# Altium schematic sheet Sheet_1_2021-12-04.schdoc
size 187 x 111 mm
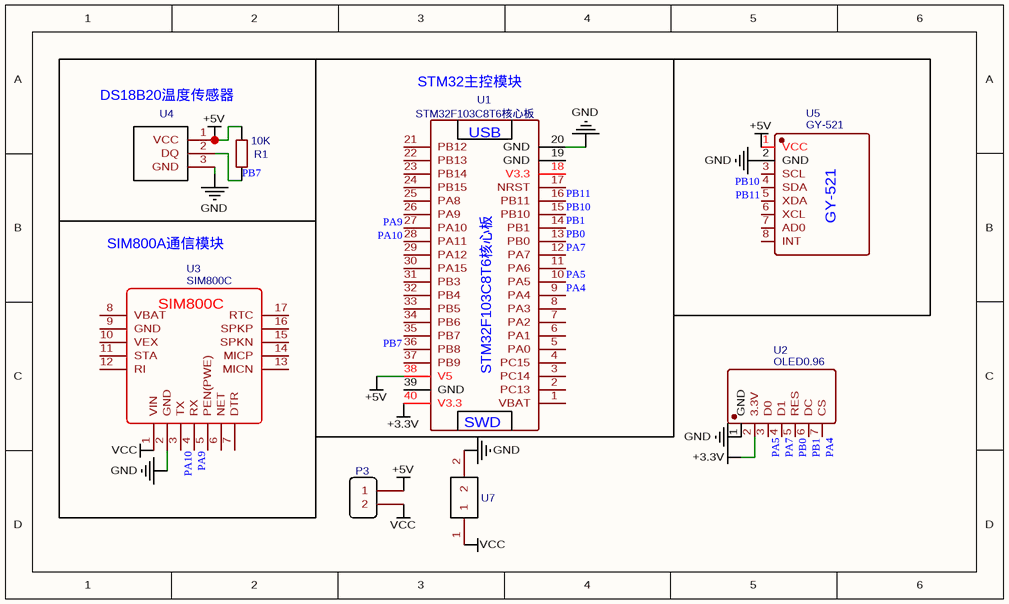
[diagram p0: Sheet_1_2021-12-04.schdoc]

## Parts
P3  2.54-1*2P_ZX  [2.54-1*2P_TIGHT_JX]  (value not drawn)
R1  10K  [AXIAL-0.5]
U1  STM32F103C8T6核心板  [STM32F103C8T6核心板]
U2  OLED0.96  [OLED]
U3  SIM800C  [SIM800C模块-DIP_MK]
U4  DS18B20（防水版）  [DS18B20（防水版）]  (value not drawn)
U5  GY-521  [GY-521_FOOTPRINT]
U7  双排针2×1P  [双排针2×1]  (value not drawn)

## Blocks framed on the sheet
DS18B20温度传感器: R1 U4
STM32主控模块: U1
SIM800A通信模块: U3

## Nets
+3.3V: U1.40(V3.3) U2.2(3.3V)
+5V: P3.1 R1.2 U1.38(V5) U4.1(VCC) U5.1(VCC)
GND: U1.20(GND) U2.1(GND) U3.2(GND) U4.3(GND) U5.2(GND) U7.2
VCC: P3.2 U3.1(VIN) U7.1
PA4: U1.9(PA4) U2.7(CS)
PA5: U1.10(PA5) U2.3(D0)
PA7: U1.12(PA7) U2.4(D1)
PA9: U1.26(PA9) U3.4(RX)
PA10: U1.27(PA10) U3.3(TX)
PB0: U1.13(PB0) U2.5(RES)
PB1: U1.14(PB1) U2.6(DC)
PB7: R1.1 U1.35(PB7) U4.2(DQ)
PB10: U1.15(PB10) U5.3(SCL)
PB11: U1.16(PB11) U5.4(SDA)

Not connected (* = marked no-connect by the designer): U1 1(VBAT) 2(PC13) 3(PC14) 4(PC15) 5(PA0) 6(PA1) 7(PA2) 8(PA3) 11(PA6) 17(NRST) 18(V3.3) 19(GND) 21(PB12) 22(PB13) 23(PB14) 24(PB15) 25(PA8) 28(PA11) 29(PA12) 30(PA15) 31(PB3) 32(PB4) 33(PB5) 34(PB6) 36(PB8) 37(PB9) 39(GND); U3 5(PEN(PWE)) 6(NET) 7(DTR) 8(VBAT) 9(GND) 10(VEX) 11(STA) 12(RI) 13(MICN) 14(MICP) 15(SPKN) 16(SPKP) 17(RTC); U5 5(XDA) 6(XCL) 7(AD0) 8(INT)

## Notes on the sheet
- (in symbol STM32F103C8T6核心板) USB; SWD

## Library data of the parts
R1 = 10K: BOM_Manufacturer: CCO; BOM_Manufacturer Part: CF1/2W-330Ω±5% T52; nameAlias: Resistance (Ohms); Power (Watts): 1/2W; Tolerance: ±5%; BOM_Supplier Part: C120226; BOM_Supplier: LCSC; spicePre: R; spiceSymbolName: 电阻
U1 = STM32F103C8T6核心板: BOM_Manufacturer: 无; BOM_Manufacturer Part: STM32F103C8T6最小系统模块; subpart_no: 1; tags: STM32; Contributor: Kolin; timeStamp: 1455028086; BOM_Supplier Part: C8734; image: http://image.lceda.cn/szlcsc/C8734.jpg; spicePre: U; spiceSymbolName: STM32F103C8T6核心板
U2 = OLED0.96: Contributor: simple_ji; spicePre: U; spiceSymbolName: OLED0.96
U3 = SIM800C: Contributor: 18317631082; spicePre: U; spiceSymbolName: SIM800C
U4 = DS18B20（防水版）: Contributor: Bird; spicePre: U; spiceSymbolName: DS18B20（防水版）
U5 = GY-521: Contributor: maoMaoLan; spicePre: U; spiceSymbolName: GY-521
U7 = 双排针2×1P: Contributor: sibing2020; spicePre: U; spiceSymbolName: 双排针2×1P
P3 = 2.54-1*2P_ZX: BOM_Supplier Part: C115245; BOM_Supplier: LCSC; spicePre: P; spiceSymbolName: 2.54-1*2P_ZX